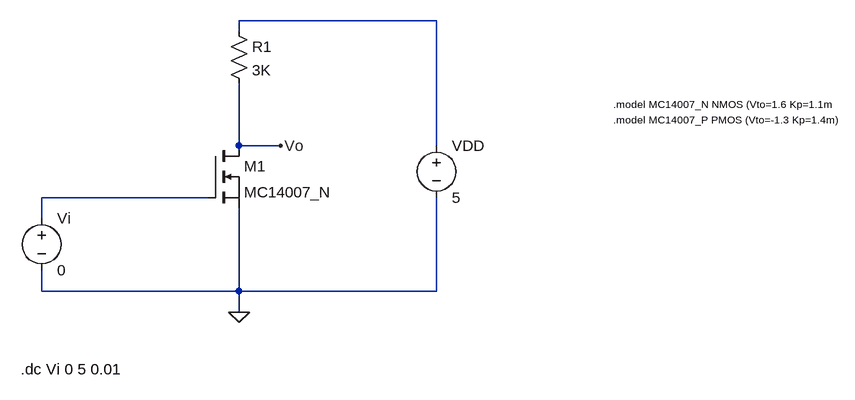
[diagram p0: schematic 1.2.1.asc]
1.2.1.asc, the LTspice schematic file:
Version 4
SHEET 1 880 680
WIRE -128 -144 -432 -144
WIRE -432 -128 -432 -144
WIRE -432 48 -432 -48
WIRE -368 48 -432 48
WIRE -128 48 -128 -144
WIRE -480 128 -736 128
WIRE -736 160 -736 128
WIRE -736 272 -736 240
WIRE -432 272 -432 144
WIRE -432 272 -736 272
WIRE -128 272 -128 128
WIRE -128 272 -432 272
WIRE -432 304 -432 272
FLAG -432 304 0
FLAG -368 48 Vo
SYMBOL nmos -480 48 R0
SYMATTR InstName M1
SYMATTR Value MC14007_N
SYMBOL voltage -128 32 R0
SYMATTR InstName VDD
SYMATTR Value 5
SYMBOL voltage -736 144 R0
SYMATTR InstName Vi
SYMATTR Value 0
SYMBOL res -448 -144 R0
SYMATTR InstName R1
SYMATTR Value 3K
TEXT 144 -16 Left 1 !.model MC14007_N NMOS (Vto=1.6 Kp=1.1m
TEXT 144 8 Left 1 !.model MC14007_P PMOS (Vto=-1.3 Kp=1.4m)
TEXT -768 392 Left 2 !.dc Vi 0 5 0.01

The netlist it stands for:
* 1.2.1.asc
M1 Vo N002 0 0 MC14007_N
VDD N001 0 5
Vi N002 0 0
R1 N001 Vo 3K
.model NMOS NMOS
.model PMOS PMOS
.lib standard.mos
.model MC14007_N NMOS (Vto=1.6 Kp=1.1m
.model MC14007_P PMOS (Vto=-1.3 Kp=1.4m)
.dc Vi 0 5 0.01
.backanno
.end